# Altium schematic sheet BlockDiagram.SchDoc
size 431 x 279 mm; DocumentNumber: 2; SheetNumber: 2; SheetTotal: 13
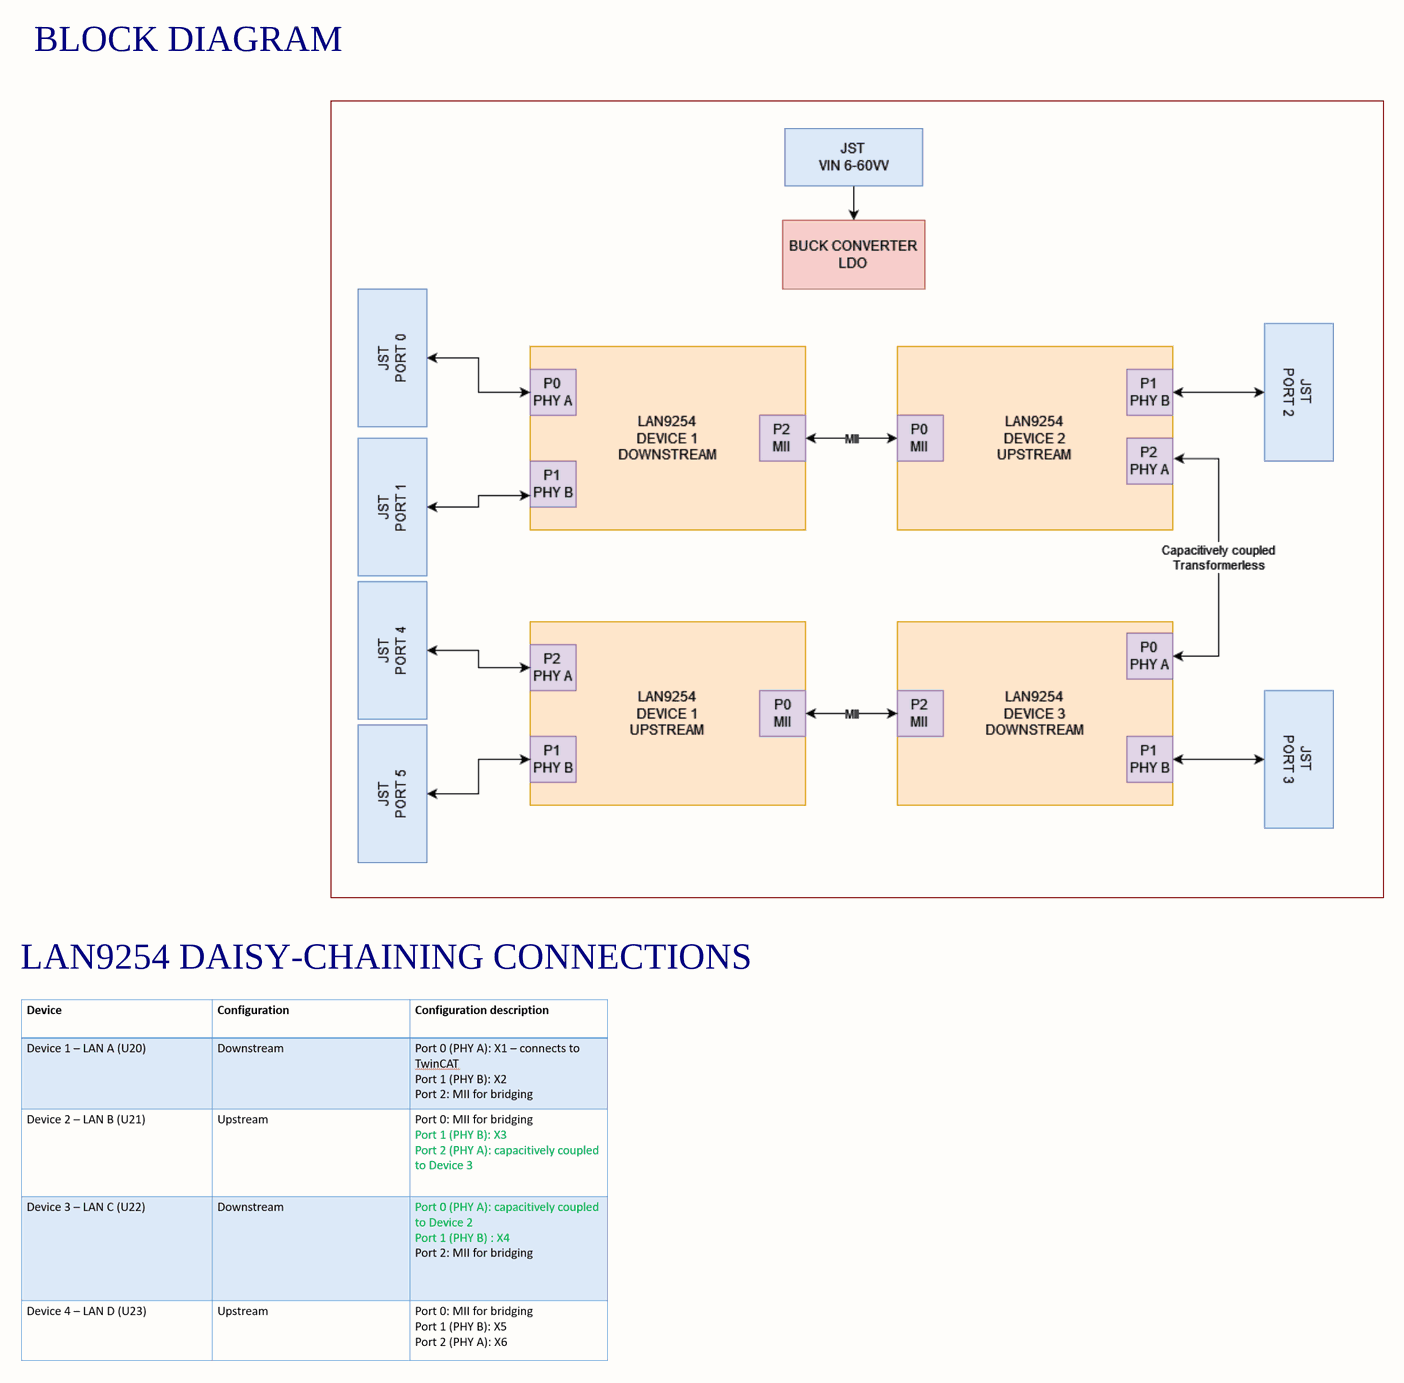
[diagram p0: BlockDiagram.SchDoc]

## Notes on the sheet
- BLOCK DIAGRAM
- LAN9254 DAISY-CHAINING CONNECTIONS
- REVISION
- DESCRIPTION
- DATE
- DESIGNED:
- CHECKED:
- TITLE:
- FILE NAME:
- CUR REV:
- PCB:
- SHEET:
- DATE:
- OF